# EAGLE design rapidshark-lipo-sensor-mk-3.7 (EAGLE 7.5.0)
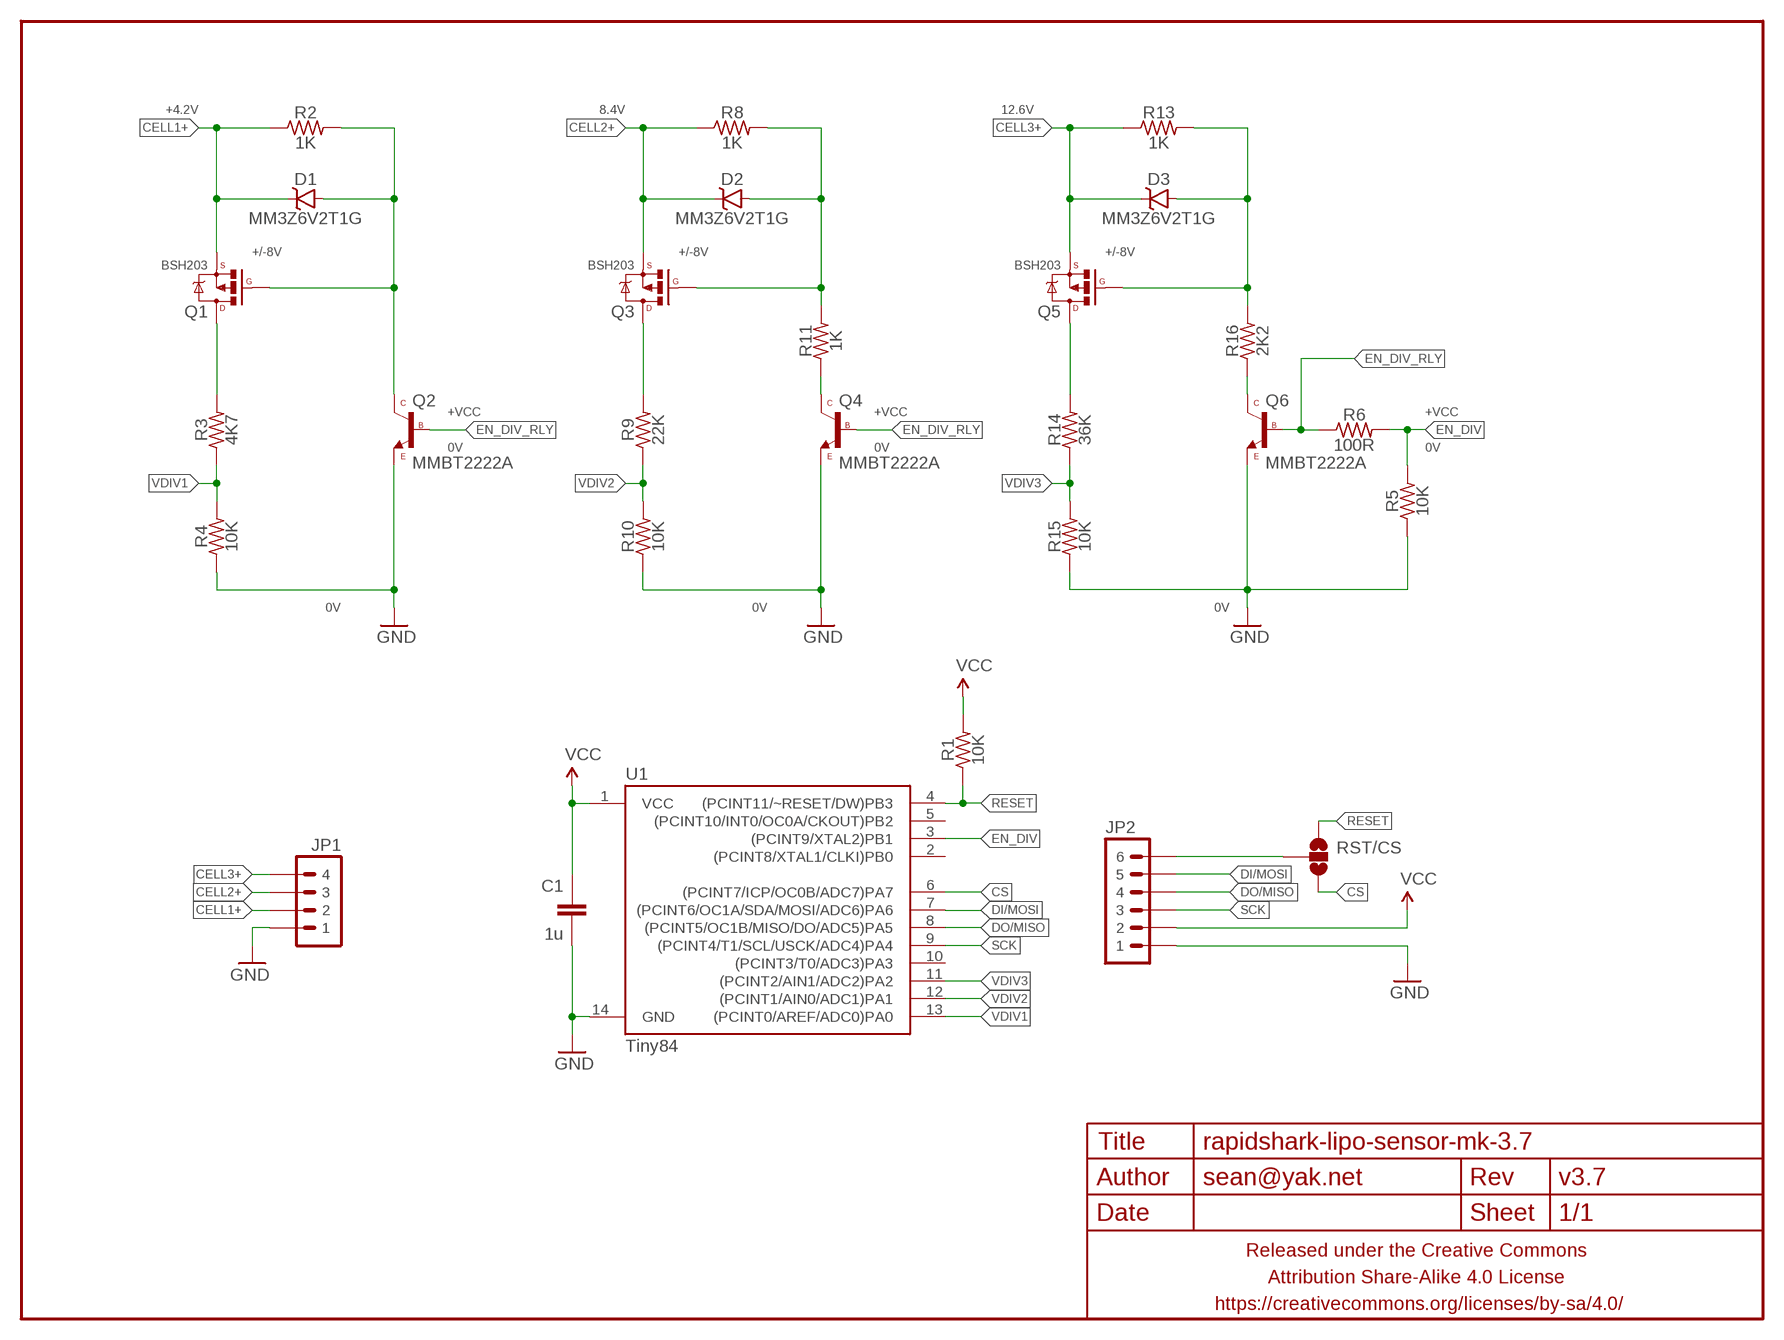
[diagram p0: schematic, sheet 1]

## Parts
C1  1u  CAPACITOR-CERAMICC0603-TIGHTER  [C0603-TIGHTER]
D1  MM3Z6V2T1G  DIODE-ZENERSOD323  [SOD323-ZENNER]
D2  MM3Z6V2T1G  DIODE-ZENERSOD323  [SOD323-ZENNER]
D3  MM3Z6V2T1G  DIODE-ZENERSOD323  [SOD323-ZENNER]
FRAME1  FRAME-LETTERNO_PACKAGE  [DUMMY]
JP1  M04JST_XH_RA  [JST-4-XH-RA-PTH]
JP2  M06PTH_CENTERED  [1X06_CENTERED]
Q1  BSH203  MOSFET-PCHANNELSOT-23  [SOT23]
Q2  MMBT2222A  TRANSISTOR_NPNMMBT2222A  [SOT23]
Q3  BSH203  MOSFET-PCHANNELSOT-23  [SOT23]
Q4  MMBT2222A  TRANSISTOR_NPNMMBT2222A  [SOT23]
Q5  BSH203  MOSFET-PCHANNELSOT-23  [SOT23]
Q6  MMBT2222A  TRANSISTOR_NPNMMBT2222A  [SOT23]
R1  10K  RESISTORR0603-TIGHTER  [R0603-TIGHTER]
R2  1K  RESISTORR0603-TIGHTER  [R0603-TIGHTER]
R3  4K7  RESISTORR0603-TIGHTER  [R0603-TIGHTER]
R4  10K  RESISTORR0603-TIGHTER  [R0603-TIGHTER]
R5  10K  RESISTORR0603-TIGHTER  [R0603-TIGHTER]
R6  100R  RESISTORR0603-TIGHTER  [R0603-TIGHTER]
R8  1K  RESISTORR0603-TIGHTER  [R0603-TIGHTER]
R9  22K  RESISTORR0603-TIGHTER  [R0603-TIGHTER]
R10  10K  RESISTORR0603-TIGHTER  [R0603-TIGHTER]
R11  1K  RESISTORR0603-TIGHTER  [R0603-TIGHTER]
R13  1K  RESISTORR0603-TIGHTER  [R0603-TIGHTER]
R14  36K  RESISTORR0603-TIGHTER  [R0603-TIGHTER]
R15  10K  RESISTORR0603-TIGHTER  [R0603-TIGHTER]
R16  2K2  RESISTORR0603-TIGHTER  [R0603-TIGHTER]
RST/CS  JUMPER-PAD-3-NOFULL_BOX_SILK  [PAD-JUMPER-3-NO_YES_SILK_FULL_BOX]
U1  Tiny84  ATTINY84  [SO14]

## Nets
CELL1+: D1.C JP1.2 Q1.2(S) R2.1
CELL2+: D2.C JP1.3 Q3.2(S) R8.1
CELL3+: D3.C JP1.4 Q5.2(S) R13.1
CS: RST/CS.3 U1.6((PCINT7/ICP/OC0B/ADC7)PA7)
DI/MOSI: JP2.5 U1.7((PCINT6/OC1A/SDA/MOSI/ADC6)PA6)
DO/MISO: JP2.4 U1.8((PCINT5/OC1B/MISO/DO/ADC5)PA5)
EN_DIV: R5.2 R6.2 U1.3((PCINT9/XTAL2)PB1)
EN_DIV_RLY: Q2.1(B) Q4.1(B) Q6.1(B) R6.1
GND: C1.2 JP1.1 JP2.1 Q2.2(E) Q4.2(E) Q6.2(E) R4.1 R5.1 R10.1 R15.1 U1.14(GND)
N$1: Q4.3(C) R11.1
N$2: Q3.3(D) R9.2
N$3: Q5.3(D) R14.2
N$5: D2.A Q3.1(G) R8.2 R11.2
N$6: Q1.3(D) R3.2
N$7: D3.A Q5.1(G) R13.2 R16.2
N$8: Q6.3(C) R16.1
N$9: D1.A Q1.1(G) Q2.3(C) R2.2
RESET: R1.1 RST/CS.1 U1.4((PCINT11/~RESET/DW)PB3)
RST/CS: JP2.6 RST/CS.2
SCK: JP2.3 U1.9((PCINT4/T1/SCL/USCK/ADC4)PA4)
VCC: C1.1 JP2.2 R1.2 U1.1(VCC)
VDIV1: R3.1 R4.2 U1.13((PCINT0/AREF/ADC0)PA0)
VDIV2: R9.1 R10.2 U1.12((PCINT1/AIN0/ADC1)PA1)
VDIV3: R14.1 R15.2 U1.11((PCINT2/AIN1/ADC2)PA2)
Unconnected: U1.2((PCINT8/XTAL1/CLKI)PB0) U1.5((PCINT10/INT0/OC0A/CKOUT)PB2) U1.10((PCINT3/T0/ADC3)PA3)

## Notes on the sheet
- +4.2V | 8.4V | 12.6V
- +/-8V | +/-8V | +/-8V
- +VCC | +VCC | +VCC
- 0V | 0V | 0V
- 0V | 0V | 0V

## Library data of the parts
C1 = a_parts:CAPACITOR-CERAMIC: CAPACITOR, European symbol
D1-D3 = a_parts:DIODE-ZENER: Zener Diode Production Part - 8199 3.4V Zener Voltage
FRAME1 = A_butts:FRAME-LETTER: Schematic Frame Standard 8.5x11 US Letter frame; DESIGNER: sean@yak.net; VERSION: v3.7
JP1 = a_parts:M04: Header 4 Standard 4-pin 0.1" header. Use with straight break away headers (SKU : PRT-00116), right angle break away headers (PRT-00553), swiss pins (PRT-00743), machine pins (PRT-00117), and female headers (PRT-00115). Molex polarized connector foot print use with SKU : PRT-08231 with associated crimp pins and housings. 1MM SMD Version SKU: PRT-10208
JP2 = a_parts:M06: Header 6 Standard 6-pin 0.1" header. Use with straight break away headers (SKU : PRT-00116), right angle break away headers (PRT-00553), swiss pins (PRT-00743), machine pins (PRT-00117), and female headers (PRT-00115). Molex polarized connector foot print use with SKU : PRT-08094 with associated crimp pins and housings. NOTES ON THE VARIANTS LOCK and LOCK_LONGPADS... This footprint was designed to help hold the alignment of a through-hole component (i.e. 6-pin header) while soldering it into place. You may notice that each hole has been shifted either up or down by 0.005 of an inch from it's more standard position (which is a perfectly straight line). This slight alteration caused the pins (the squares in the middle) to touch the edges of the holes. Because they are alternating, it causes a "brace" to hold the component in place. 0.005 has proven to be the perfect amount of "off-center" position when using our standard breakaway headers. Although looks a little odd when you look at the bare footprint, once you have a header in there, the alteration is very hard to notice. Also,if you push a header all the way into place, it is covered up entirely on the bottom side. This idea of altering the position of holes to aid alignment will be further integrated into the Sparkfun Library for other footprints. It can help hold any component with 3 or more connection pins.
Q1 Q3 Q5 = a_parts:MOSFET-PCHANNEL: Generic PMOSFET IRLML2244 - TRANS-11153 (SOT-23 -20V -4.3A) (1.Gate 2.Source 3.Drain) FQP27P06 - COM-10349 <http://www.sparkfun.com/products/10349> (TO-220 -60V -27A) (1.Gate 2.Source 3.Drain)
Q2 Q4 Q6 = a_parts:TRANSISTOR_NPN: Generic NPN BJT MMBT2222A - TRANS-08049 (SOT-23, 1A 40V) MPSA42 - TRANS-09116 (SOT-23, 500mA 300V) MMBT5088LT1G - TRANS-11160 (SOT-23, 50 mA 30V) BC547 - COM-08928 <http://www.sparkfun.com/products/8928> (TO-92 45V 100mA) (1.Collector 2.Base 3.Emitter) 2N3904 - COM-00521 <http://www.sparkfun.com/products/521> (TO-92 40V 200mA) (1.Emitter 2.Base 3.Collector) P2N2222A - COM-12852 <http://www.sparkfun.com/products/12852> (TO-92 40V 600mA) (1.Collector 2.Base 3.Emitter)
R1-R6 R8-R11 R13-R16 = a_parts:RESISTOR: RESISTOR, American symbol
RST/CS = a_parts:JUMPER-PAD-3-NO
U1 = A_butts:ATTINY84: Atmel 14-pin 2/4/8kB flash uC

## Board
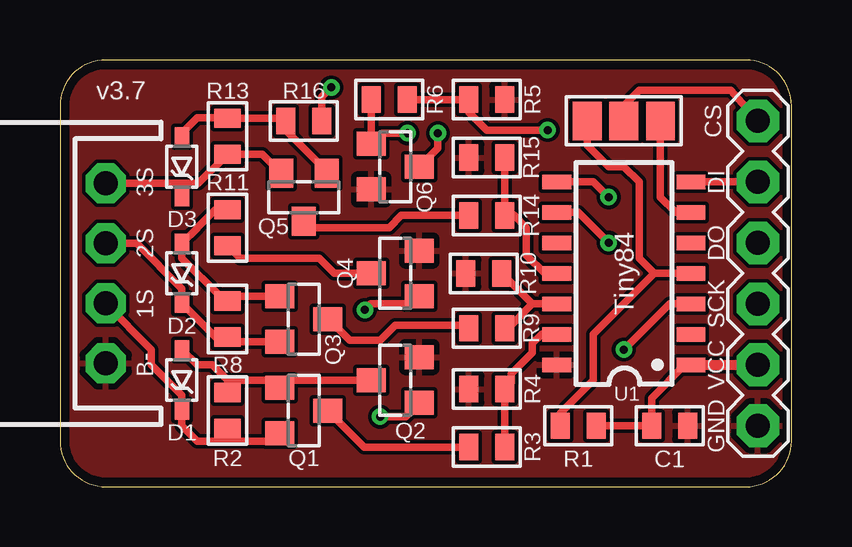
[diagram p1: board, top side]
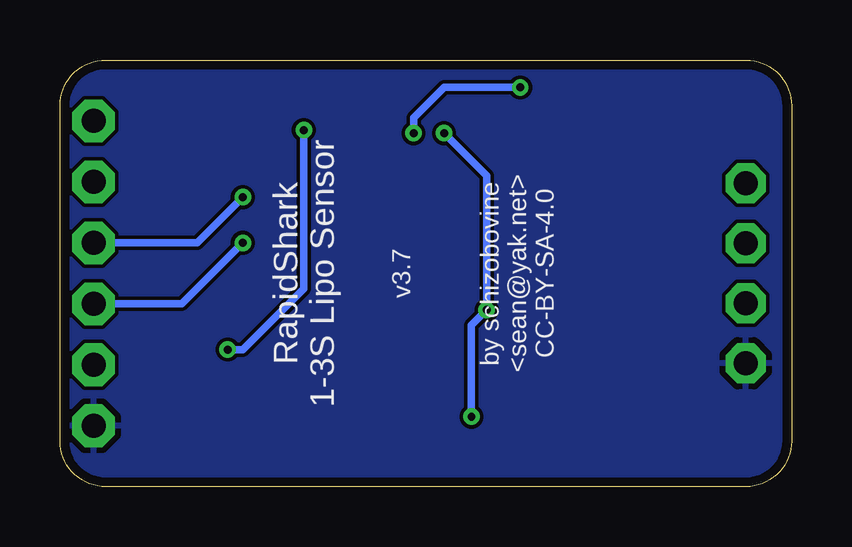
[diagram p2: board, bottom side, seen from below]

Size 30.48 x 17.78 mm. Coordinates in mm from the lower left corner, seen from the top.
Outline: 1.91,0 28.57,0 arc90 30.48,1.91 30.48,15.88 arc90 28.57,17.78 1.91,17.78 arc90 0,15.88 0,1.91 arc90 1.91,0
Copper layers (1*16): Top 0.0356mm / dielectric 1.5011mm / Bottom 0.0356mm
Design rules "LaenPCBOrder2": minimum track width 6mil, minimum drill 13mil, track to track 6mil, track to pad 6mil, pad to pad 6mil, via to via 6mil, smd to smd 6mil, copper to edge 15mil, drill to drill 6mil, minimum pad ring 7mil, minimum via ring 7mil, stop-mask expansion 3mil, vias tented up to drill 20mil, thermal gap 10mil

### Footprints (pad centres in the part's own frame; a part is rotated, then mirrored left to right if it is on the bottom)
C0603-TIGHTER = smd 0.8 x 1.1: 1 -0.75,0; 2 0.75,0
SOD323-ZENNER = smd 0.8 x 0.6: A -1.25,0; C 1.25,0
JST-4-XH-RA-PTH = drill 1 pad 1.676 octagon: 1 -3.75,0; 2 -1.25,0; 3 1.25,0; 4 3.75,0
1X06_CENTERED = drill 1 pad 1.778 octagon: 1 -6.35,0; 2 -3.81,0; 3 -1.27,0; 4 1.27,0; 5 3.81,0; 6 6.35,0
SOT23 = smd 1 x 1.2: 1 -0.95,-1; 2 0.95,-1; 3 0,1
R0603-TIGHTER = smd 0.8 x 1.1: 1 -0.75,0; 2 0.75,0
PAD-JUMPER-3-NO_YES_SILK_FULL_BOX = smd 1.2 x 1.6: 1 -1.524,0; 2 0,0; 3 1.524,0
SO14 = smd 0.6 x 1.2: 1 -3.81,-2.8; 2 -2.54,-2.8; 3 -1.27,-2.8; 4 0,-2.8; 5 1.27,-2.8; 6 2.54,-2.8; 7 3.81,-2.8; 8 3.81,2.8; 9 2.54,2.8; 10 1.27,2.8; 11 0,2.8; 12 -1.27,2.8; 13 -2.54,2.8; 14 -3.81,2.8

### Placement (x,y rotation side)
C1  25.4,2.54 0 top
D1  5.08,4.45 270 top
D2  5.08,8.89 270 top
D3  5.08,13.34 270 top
FRAME1  0,0 0 top
JP1  1.91,8.89 90 top
JP2  29.08,8.89 90 top
Q1  10.16,3.17 270 top
Q2  13.97,4.45 90 top
Q3  10.16,6.99 270 top
Q4  13.97,8.89 90 top
Q5  10.16,12.06 180 top
Q6  13.97,13.34 270 top
R1  21.59,2.54 0 top
R2  6.99,3.17 90 top
R3  17.78,1.65 180 top
R4  17.78,4.06 0 top
R5  17.78,16.13 180 top
R6  13.72,16.13 0 top
R8  6.99,6.99 90 top
R9  17.78,6.6 180 top
R10  17.65,8.89 0 top
R11  6.99,10.79 90 top
R13  6.99,14.61 90 top
R14  17.78,11.3 180 top
R15  17.78,13.72 0 top
R16  10.16,15.24 180 top
RST/CS  23.5,15.24 0 top
U1  23.5,8.89 90 top

### Tracks (layer width: path | path; a pad name or v marks a point on that pad's centre or on a via)
CELL1+
  Top 0.305: JP1.2 1.91,7.62 3.81,5.71 3.81,5.08 5.08,3.81 D1.C 5.08,2.54 5.71,1.91 6.99,1.91 | 6.99,1.91 8.84,1.91 Q1.2 | R2.1 6.99,1.91
CELL2+
  Top 0.305: JP1.3 3.19,10.14 5.08,8.26 D2.C 6.49,6.24 R8.1 7.18,6.04 Q3.2
CELL3+
  Top 0.305: JP1.4 5.08,12.64 | 5.08,12.64 5.77,12.64 R13.1 8.42,13.86 Q5.2 | D3.C 5.08,12.64
CS
  Top 0.305: U1.6 25.65,11.43 25.02,12.06 RST/CS.3
DI/MOSI
  Top 0.305: U1.7 JP2.5
DO/MISO  (via drill 0.33)
  Top 0.305: U1.8 22.23,12.7 v22.86,12.06
  Bottom 0.305: v22.86,12.06 24.77,10.16 JP2.4
EN_DIV  (via drill 0.33)
  Top 0.305: R6.2 R5.2 17.03,15.61 17.78,14.86 v20.32,14.86 | U1.3 25.4,7.62 v23.5,5.71
  Bottom 0.305: v23.5,5.71 22.86,5.71 20.32,8.26 v20.32,14.86
EN_DIV_RLY  (via drill 0.33)
  Top 0.305: Q2.1 14.4,2.92 v13.34,2.92 | Q4.1 14.65,7.62 12.95,7.62 v12.7,7.37 | v14.48,14.73 13.42,14.73 Q6.1 R6.1
  Bottom 0.305: v13.34,2.92 13.34,6.73 v12.7,7.37 12.7,12.95 v14.48,14.73
GND
  pour Bottom: 30.48,15.88 30.48,1.91 arc-90 28.57,0 1.91,0 arc-90 0,1.91 0,15.88 arc-90 1.91,17.78 28.57,17.78 arc-90
  pour Top: 30.48,15.88 30.48,1.91 arc-90 28.57,0 1.91,0 arc-90 0,1.91 0,15.88 arc-90 1.91,17.78 28.57,17.78 arc-90
N$1
  Top 0.305: R11.1 7.5,9.53 10.79,9.53 11.43,8.89 Q4.3
N$2
  Top 0.305: R9.2 16.9,6.73 13.97,6.73 13.34,6.1 12.06,6.1 11.18,6.99 Q3.3
N$3
  Top 0.305: Q5.3 10.43,10.79 13.72,10.79 14.22,11.3 R14.2
N$5
  Top 0.305: 6.99,7.93 6.67,7.93 5.08,9.53 D2.A 5.71,10.78 5.71,10.79 6.46,11.54 R11.2 | 6.99,7.93 Q3.1 | R8.2 6.99,7.93
N$6
  Top 0.305: Q1.3 12.68,1.65 R3.2
N$7
  Top 0.305: D3.A 5.08,14.73 5.71,15.37 6.97,15.37 R13.2 9.29,15.36 R16.2 9.41,14.85 11.11,13.15 Q5.1
N$8  (via drill 0.33)
  Top 0.305: Q6.3 15.75,14.11 v15.75,14.73 | v11.3,16.64 10.91,16.24 R16.1
  Bottom 0.305: v15.75,14.73 15.75,15.37 14.48,16.64 v11.3,16.64
N$9
  Top 0.305: D1.A 5.1,5.7 5.71,5.08 6.35,5.08 6.99,4.45 | 6.99,4.45 R2.2 | 6.99,4.45 8.84,4.45 Q1.1 9.48,4.45 Q2.3
RESET
  Top 0.305: U1.4 24.77,8.89 | 24.77,8.89 22.23,6.35 22.23,4.45 20.84,3.06 R1.1 | RST/CS.1 21.97,14.22 22.86,13.34 23.5,13.34 24.13,12.7 24.13,9.53 24.77,8.89
RST/CS
  Top 0.305: RST/CS.2 23.5,15.88 24.13,16.51 27.94,16.51 JP2.6
SCK  (via drill 0.33)
  Top 0.305: U1.9 21.59,11.43 v22.86,10.16
  Bottom 0.305: v22.86,10.16 25.4,7.62 JP2.3
VCC
  Top 0.305: R1.2 C1.1 24.65,3.69 26.04,5.08 U1.1
  Top 0.406: U1.1 JP2.2
VDIV1
  Top 0.305: U1.13 20.07,6.35 19.68,5.97 19.68,5.59 18.8,4.7 18.8,4.33 R4.2 R3.1
VDIV2
  Top 0.305: U1.12 19.68,7.62 | R10.2 18.41,8.89 19.68,7.62 | R9.1 18.67,6.6 19.68,7.62
VDIV3
  Top 0.305: U1.11 20.19,8.89 19.43,9.65 19.43,10.79 18.92,11.3 R14.1 R15.2

### Text on the board
tPlace: CS | 3S | DI | 2S | DO | 1S | SCK | B- | VCC | GND
bPlace: by schizobovine / <sean@yak.net> / CC-BY-SA-4.0 | RapidShark / 1-3S Lipo Sensor